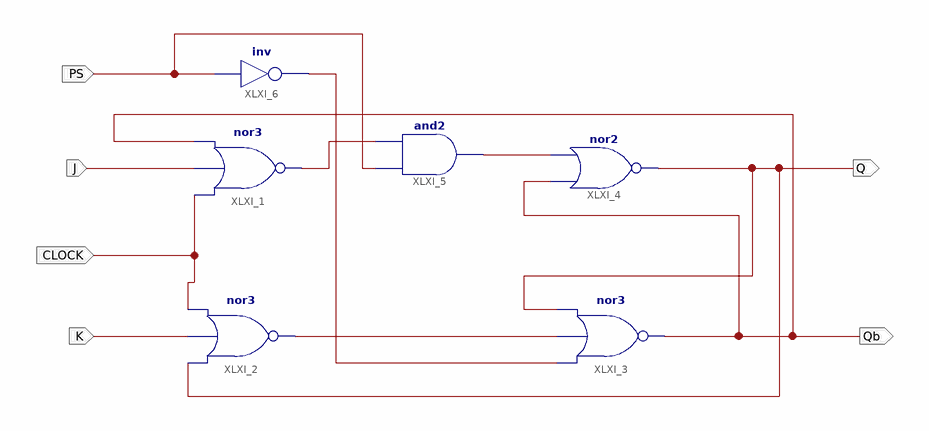
[diagram p0: schematic sheet 1]
// Xilinx ISE schematic JK_Latch_NOR.sch (artix7) as structural Verilog: 6 symbols, 6 ports
module JK_Latch_NOR (
  input  PS,
  input  CLOCK,
  input  J,
  input  K,
  output Q,
  output Qb
);

  wire XLXN_1, XLXN_2, XLXN_3, XLXN_4;

  nor XLXI_1 (XLXN_4, CLOCK, J, Qb);
  nor XLXI_2 (XLXN_2, Q, K, CLOCK);
  nor XLXI_3 (Qb, XLXN_1, XLXN_2, Q);
  nor XLXI_4 (Q, Qb, XLXN_3);
  and XLXI_5 (XLXN_3, PS, XLXN_4);
  not XLXI_6 (XLXN_1, PS);
endmodule
